# Altium schematic sheet Cells.SchDoc: Support à batteries
size A4; DocumentNumber: 3; Revision: Anouar Hanafi; SheetNumber: 2; SheetTotal: 8; Version: Beta 1.0; Conceptor: Philippe Turgeon
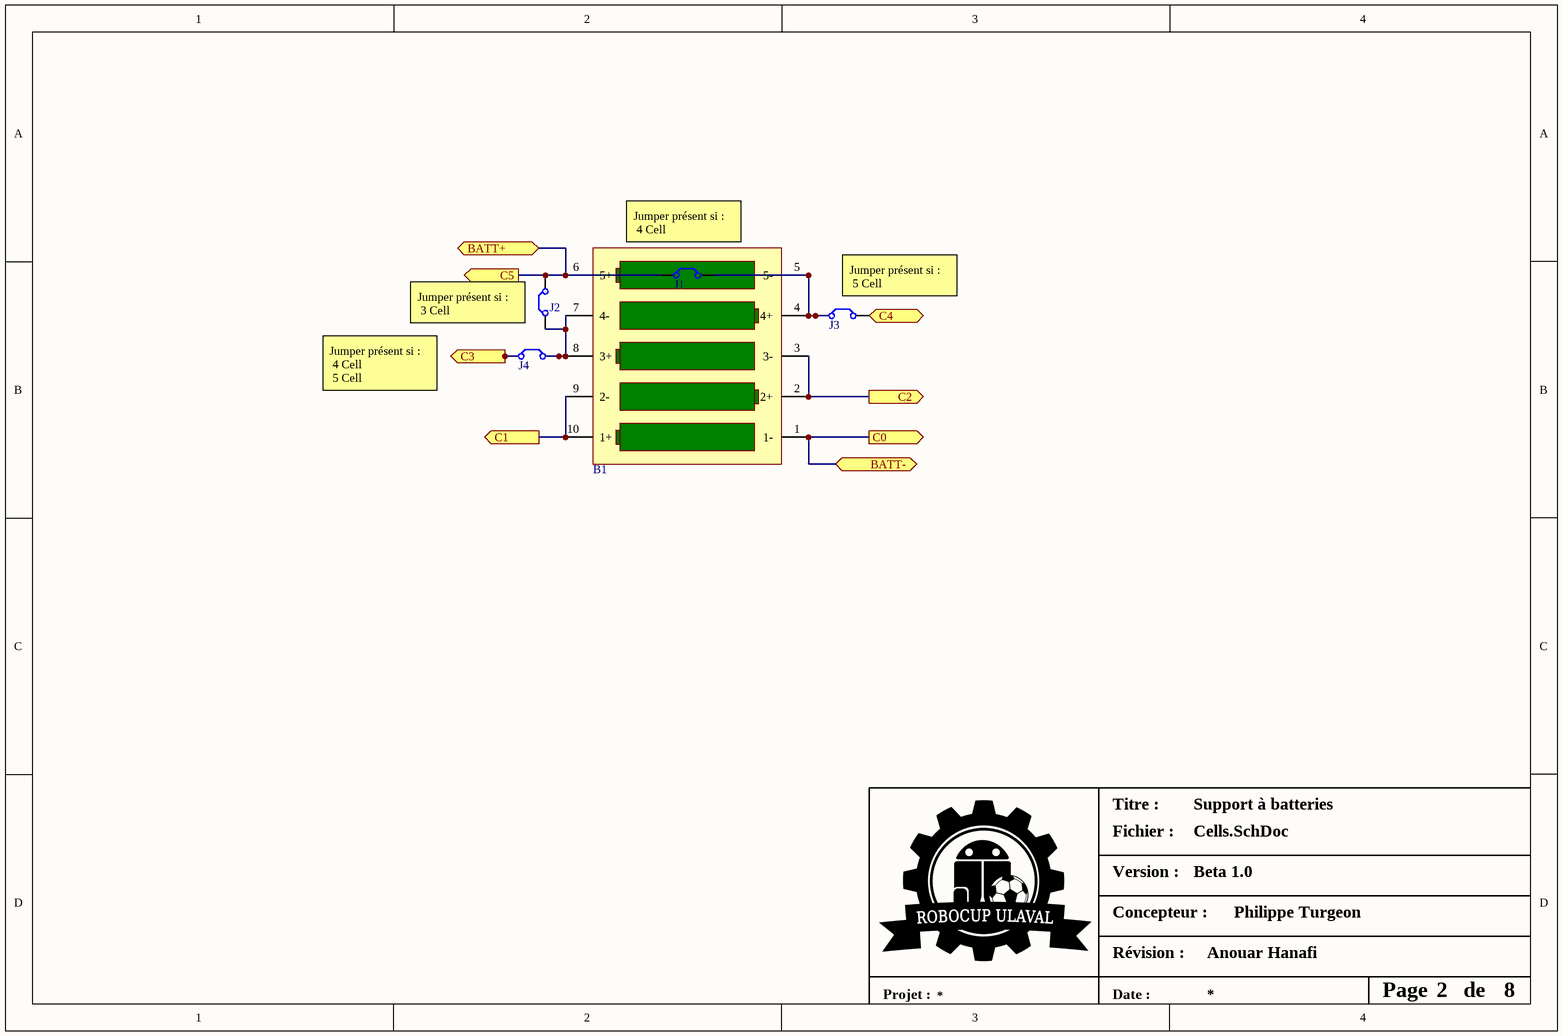
[diagram p0: Cells.SchDoc]

## Parts
B1  18650-5cell  (value not drawn)
J1  jumper  [0805]  (value not drawn)
J2  jumper  [0805]  (value not drawn)
J3  jumper  [0805]  (value not drawn)
J4  jumper  [0805]  (value not drawn)

## Ports
BATT+, BATT-, C0 (out), C1 (out), C2 (out), C3 (out), C4 (out), C5 (out)

## Nets
BATT+: B1.6(5+) J1.1 J2.2 ; port BATT+, port C5
BATT-: B1.1(1-) ; port C0, port BATT-
C1: B1.9(2-) B1.10(1+) ; port C1
C2: B1.2(2+) B1.3(3-) ; port C2
C3: J4.1 ; port C3
C4: J3.2 ; port C4
NetB1_4: B1.4(4+) B1.5(5-) J1.2 J3.1
NetB1_7: B1.7(4-) B1.8(3+) J2.1 J4.2

## Notes on the sheet
- Jumper présent si :
  4 Cell
- (near J3) Jumper présent si :
  5 Cell
- Jumper présent si :
  4 Cell
  5 Cell
- Jumper présent si :
  3 Cell
- Titre :
- Fichier :
- Version :
- Concepteur :
- Révision :
- Projet :
- Date :
- Page
- de

## Library data of the parts
B1 = 18650-5cell: BATT LI-ION 5 CELL; Battery Cell Size: 18650